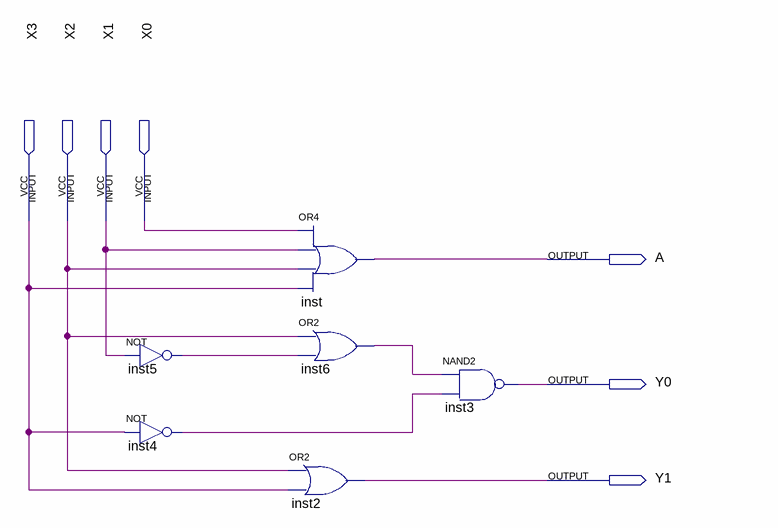
[diagram p0: schematic sheet]
// Quartus schematic q4.bdf as structural Verilog: 6 symbols, 7 pins
module q4 (
  input  X3,
  input  X2,
  input  X1,
  input  X0,
  output A,
  output Y0,
  output Y1
);

  wire inst4_out, inst5_out, inst6_out;

  not inst5 (inst5_out, X1);
  not inst4 (inst4_out, X3);
  or inst (A, X0, X1, X2, X3);
  or inst6 (inst6_out, X2, inst5_out);
  or inst2 (Y1, X2, X3);
  nand inst3 (Y0, inst6_out, inst4_out);
endmodule
